# EAGLE design akabeacon_square_MDBT40 (EAGLE 7.2.0)
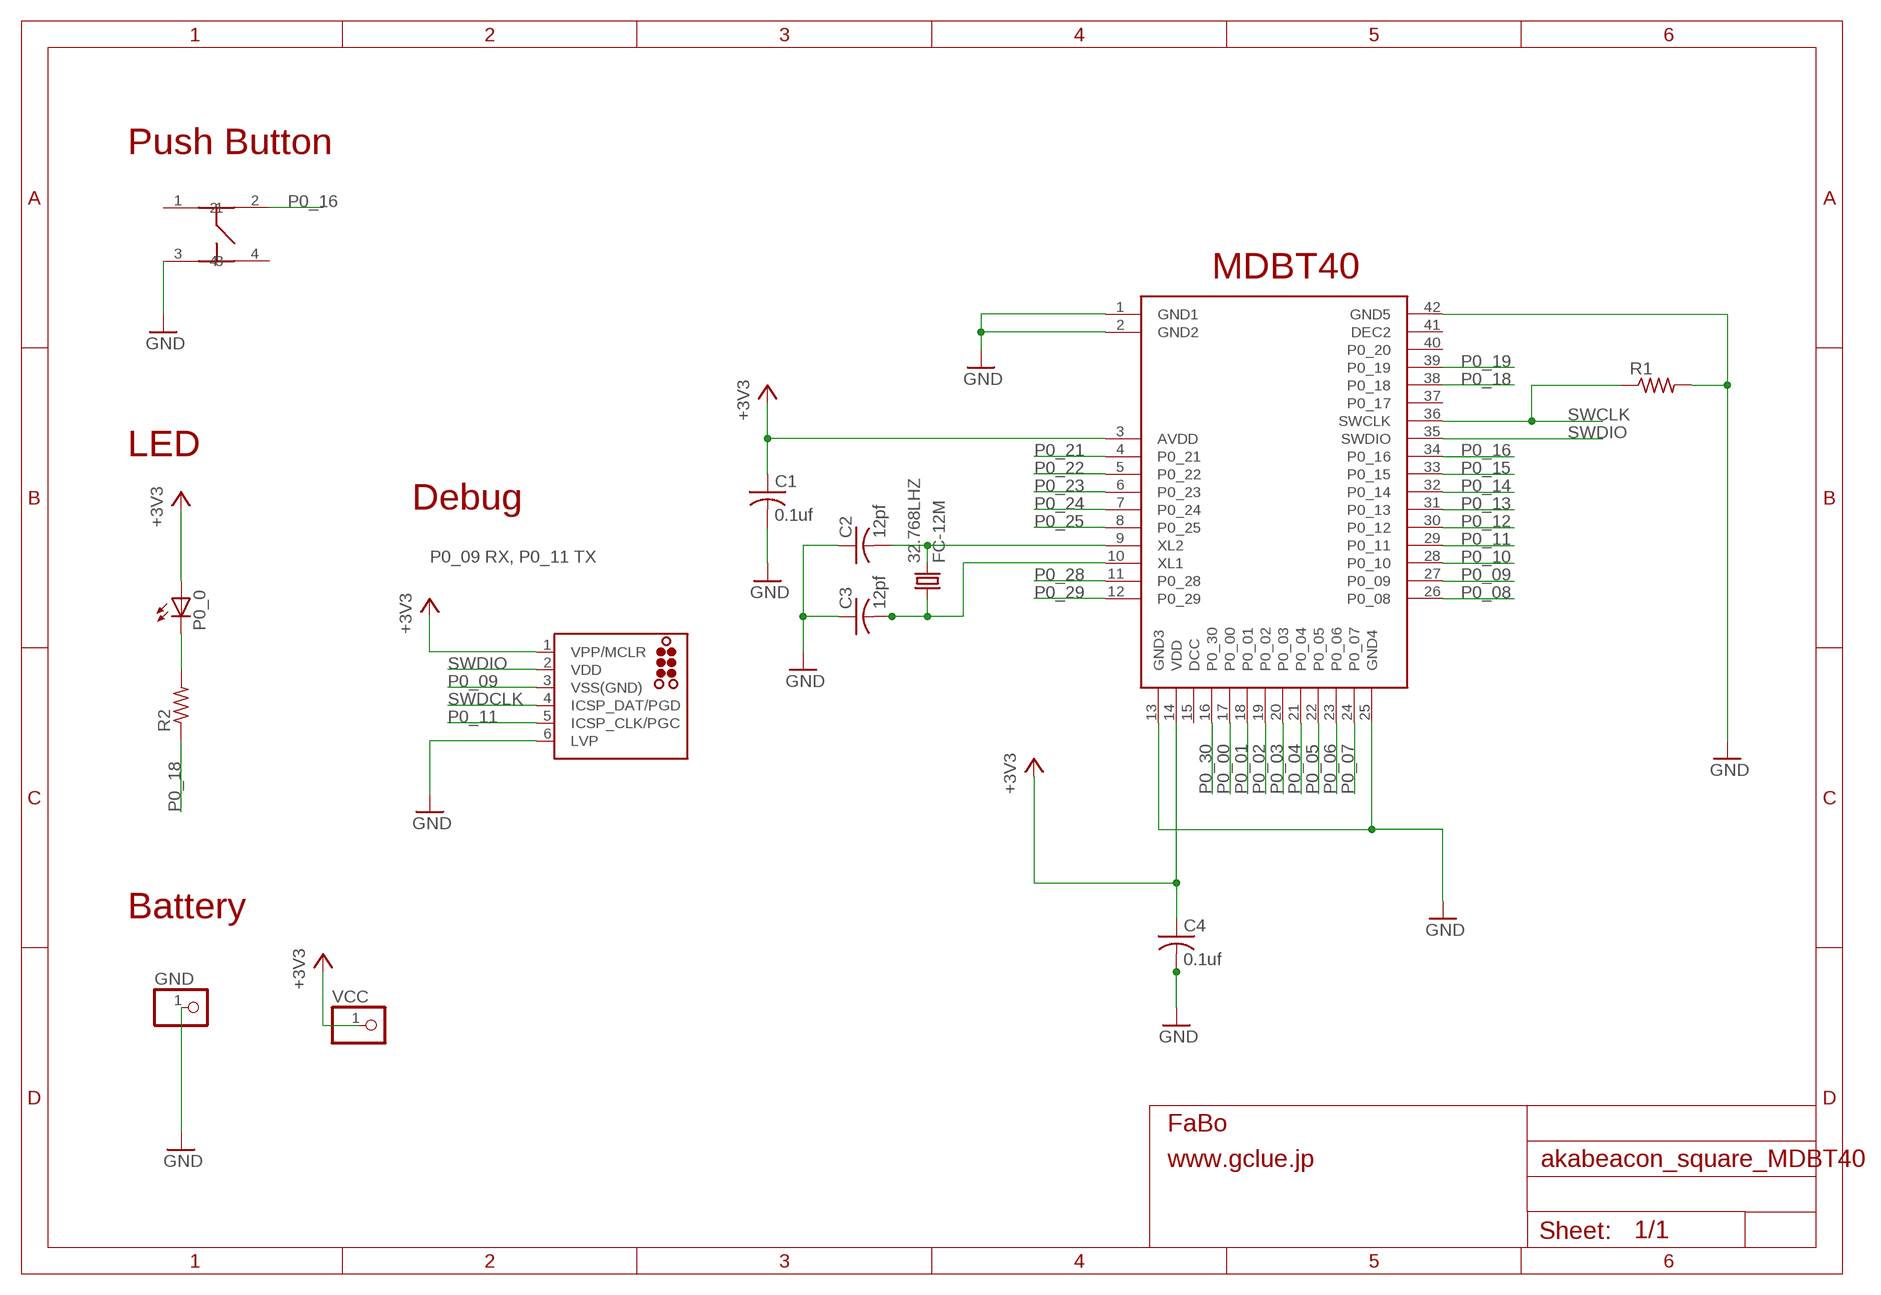
[diagram p0: schematic, sheet 1]

## Parts
32.768LHZ  FC-12M  [FC-12M]
C1  0.1uf  C-USC0603  [C0603]
C2  12pf  C-USC0603  [C0603]
C3  12pf  C-USC0603  [C0603]
C4  0.1uf  C-USC0603  [C0603]
GND  PINHD-1X1CB  [1X01-CLEANBIG]
J2  TC2030-MCP  [TC2030-MCP]
P0_0  LEDCHIP-LED0603  [CHIP-LED0603]
R1  R-US_R0603  [R0603]
R2  R-US_R0603  [R0603]
U$3  RAYTAC-MDBT40  [RAYTAC-MDBT40]
U$6  SWICTH-4P(KMR2)  [SWITCH-4P(KMR2)]
VCC  PINHD-1X1CB  [1X01-CLEANBIG]

## Nets
+3V3: C1.1 C4.1 J2.1(VPP/MCLR) P0_0.A U$3.3(AVDD) U$3.14(VDD) VCC.1
GND: C1.2 C2.1 C3.1 C4.2 GND.1 J2.6(LVP) R1.2 U$3.1(GND1) U$3.2(GND2) U$3.13(GND3) U$3.25(GND4) U$3.42(GND5) U$6.3
LED1: P0_0.C R2.2
N$7: 32.768LHZ.2 C2.2 U$3.9(XL2)
N$8: 32.768LHZ.1 C3.2 U$3.10(XL1)
P0_00: U$3.17(P0_00)
P0_01: U$3.18(P0_01)
P0_02: U$3.19(P0_02)
P0_03: U$3.20(P0_03)
P0_04: U$3.21(P0_04)
P0_05: U$3.22(P0_05)
P0_06: U$3.23(P0_06)
P0_07: U$3.24(P0_07)
P0_08: U$3.26(P0_08)
P0_09: J2.3(VSS(GND)) U$3.27(P0_09)
P0_10: U$3.28(P0_10)
P0_11: J2.5(ICSP_CLK/PGC) U$3.29(P0_11)
P0_12: U$3.30(P0_12)
P0_13: U$3.31(P0_13)
P0_14: U$3.32(P0_14)
P0_15: U$3.33(P0_15)
P0_16: U$3.34(P0_16) U$6.2
P0_18: R2.1 U$3.38(P0_18)
P0_19: U$3.39(P0_19)
P0_21: U$3.4(P0_21)
P0_22: U$3.5(P0_22)
P0_23: U$3.6(P0_23)
P0_24: U$3.7(P0_24)
P0_25: U$3.8(P0_25)
P0_28: U$3.11(P0_28)
P0_29: U$3.12(P0_29)
P0_30: U$3.16(P0_30)
SWCLK: R1.1 U$3.36(SWCLK)
SWDCLK: J2.4(ICSP_DAT/PGD)
SWDIO: J2.2(VDD) U$3.35(SWDIO)
Unconnected: U$3.15(DCC) U$3.37(P0_17) U$3.40(P0_20) U$3.41(DEC2) U$6.1 U$6.4

## Notes on the sheet
- Push Button
- MDBT40
- LED
- Debug
- P0_09 RX, P0_11 TX
- Battery

## Library data of the parts
32.768LHZ = crystal:FC-12M: kHz RANGE CRYSTAL UNIT LOW PROFILE SMD Source: Epson Toyocom FC-12M.pdf
C1-C4 = adafruit:C-US: CAPACITOR, American symbol
GND VCC = adafruit:PINHD-1X1: Pin header 1x1 for 0.1" spacing With round pins
J2 = tag-connect:TC2030: TAG-CONNECT ICSP Connector Manufacturer: Tag-Connect <http://www.tag-connect.com> Cable for easy In-Circuit Serial Programming. Designed for Microchip ICD2, suitable for many others. Two variants - one "with legs" (for hands-free fit on PCB) and another "without legs" for quick programming. PAD Description 1 MCLR/Vpp 2 Vdd 3 GND 4 PGD (ISPDAT) 5 PGC (ISPCLK) 6 nc (used for LVP) ©2009 ROFA.cz - modified and updated by Robert Darlington ‹rdarlington@gmail.com›
P0_0 = led:LED: LED OSRAM: - CHIPLED LG R971, LG N971, LY N971, LG Q971, LY Q971, LO R971, LY R971 LH N974, LH R974 LS Q976, LO Q976, LY Q976 LO Q996 - Hyper CHIPLED LW Q18S LB Q993, LB Q99A, LB R99A - SideLED LS A670, LO A670, LY A670, LG A670, LP A670 LB A673, LV A673, LT A673, LW A673 LH A674 LY A675 LS A676, LA A676, LO A676, LY A676, LW A676 LS A679, LY A679, LG A679 - Hyper Micro SIDELED® LS Y876, LA Y876, LO Y876, LY Y876 LT Y87S - SmartLED LW L88C, LW L88S LB L89C, LB L89S, LG L890 LS L89K, LO L89K, LY L89K LS L896, LA L896, LO L896, LY L896 - TOPLED LS T670, LO T670, LY T670, LG T670, LP T670 LSG T670, LSP T670, LSY T670, LOP T670, LYG T670 LG T671, LOG T671, LSG T671 LB T673, LV T673, LT T673, LW T673 LH T674 LS T676, LA T676, LO T676, LY T676, LB T676, LH T676, LSB T676, LW T676 LB T67C, LV T67C, LT T67C, LS T67K, LO T67K, LY T67K, LW E67C LS E67B, LA E67B, LO E67B, LY E67B, LB E67C, LV E67C, LT E67C LW T67C LS T679, LY T679, LG T679 LS T770, LO T770, LY T770, LG T770, LP T770 LB T773, LV T773, LT T773, LW T773 LH T774 LS E675, LA E675, LY E675, LS T675 LS T776, LA T776, LO T776, LY T776, LB T776 LHGB T686 LT T68C, LB T68C - Hyper Mini TOPLED® LB M676 - Mini TOPLED Santana® LG M470 LS M47K, LO M47K, LY M47K Source: http://www.osram.convergy.de LUXEON: - LUMILED® LXK2-PW12-R00, LXK2-PW12-S00, LXK2-PW14-U00, LXK2-PW14-V00 LXK2-PM12-R00, LXK2-PM12-S00, LXK2-PM14-U00 LXK2-PE12-Q00, LXK2-PE12-R00, LXK2-PE12-S00, LXK2-PE14-T00, LXK2-PE14-U00 LXK2-PB12-K00, LXK2-PB12-L00, LXK2-PB12-M00, LXK2-PB14-N00, LXK2-PB14-P00, LXK2-PB14-Q00 LXK2-PR12-L00, LXK2-PR12-M00, LXK2-PR14-Q00, LXK2-PR14-R00 LXK2-PD12-Q00, LXK2-PD12-R00, LXK2-PD12-S00 LXK2-PH12-R00, LXK2-PH12-S00 LXK2-PL12-P00, LXK2-PL12-Q00, LXK2-PL12-R00 Source: www.luxeon.com KINGBRIGHT: KA-3528ASYC Source: www.kingbright.com
R1 R2 = adafruit:R-US_: RESISTOR, American symbol
U$3 = gclueBT:RAYTAC-MDBT40
U$6 = gclue-test:SWICTH-4P(KMR2)

## Board
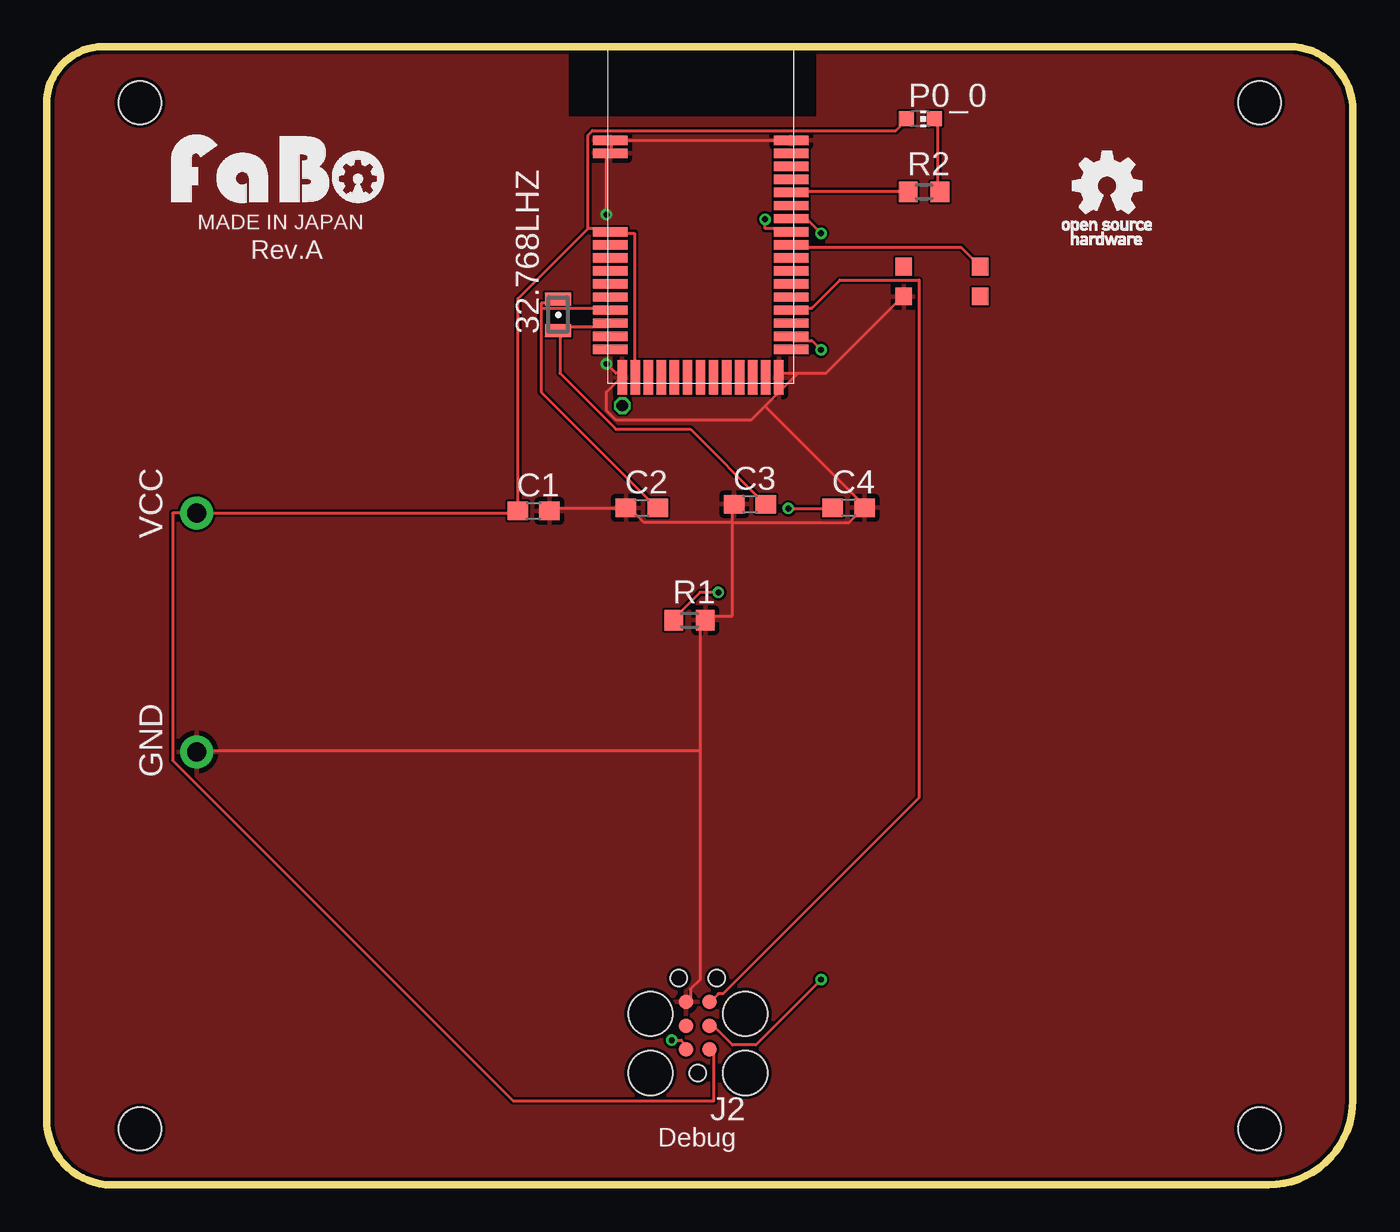
[diagram p1: board, top side]
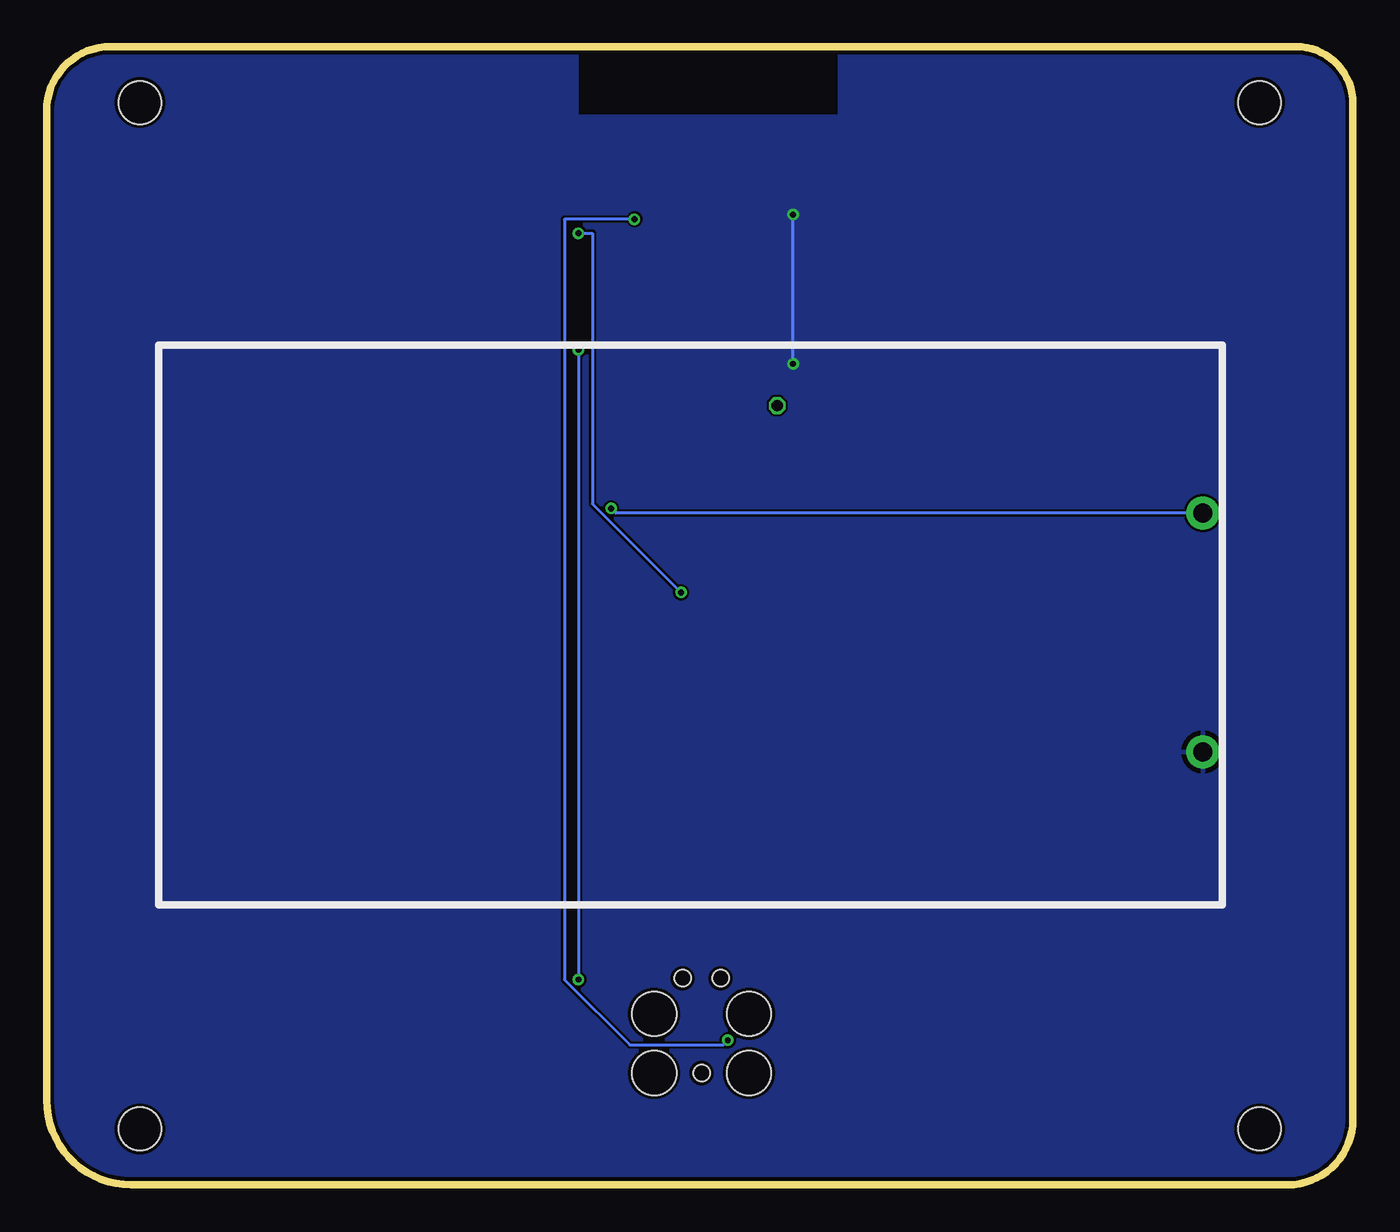
[diagram p2: board, bottom side, seen from below]

Size 70 x 61 mm. Coordinates in mm from the lower left corner, seen from the top.
Outline: 0,57.97 0,3.49 arc90 3.49,0 65.47,0 arc90 70,4.53 70,57.58 arc90 66.58,61 3.03,61 arc90 0,57.97
Copper layers (1*16): Top 0.035mm / dielectric 1.5mm / Bottom 0.035mm
Design rules "SeeedStudio_2layer_DRU_no_angle_20140221 *": minimum track width 6mil, minimum drill 12mil, track to track 5mil, track to pad 5mil, pad to pad 5mil, via to via 5mil, smd to smd 0mil, copper to edge 8mil, drill to drill 8mil, minimum pad ring 10mil, minimum via ring 6mil, stop-mask expansion 2mil, vias tented up to drill 100mil, thermal gap 10mil
Holes 2.3 mm at 5,3 5,58 65,58 65,3

### Footprints (pad centres in the part's own frame; a part is rotated, then mirrored left to right if it is on the bottom)
FC-12M = smd 0.7 x 1.4: 1 -0.85,0; 2 0.85,0
C0603 = smd 1.1 x 1: 1 -0.85,0; 2 0.85,0
1X01-CLEANBIG = drill 1.016 pad 1.778: 1 0,0
TC2030-MCP = smd 0.787 x 0.787: 1 1.27,-0.635; 2 1.27,0.635; 3 2.54,-0.635; 4 2.54,0.635; 5 3.81,-0.635; 6 3.81,0.635 | hole 0.889: 0,0; 5.08,-1.016; 5.08,1.016 | hole 2.375: 0,2.54; 0,-2.54; 3.175,-2.54; 3.175,2.54
CHIP-LED0603 = smd 0.8 x 0.8: A 0,-0.75; C 0,0.75
R0603 = smd 1 x 1.1: 1 -0.85,0; 2 0.85,0
RAYTAC-MDBT40 = smd 1.85 x 0.5: 1 -4.86,4; 2 -4.86,3.3; 3 -4.86,-0.9; 4 -4.86,-1.6; 5 -4.86,-2.3; 6 -4.86,-3; 7 -4.86,-3.7; 8 -4.86,-4.4; 9 -4.86,-5.1; 10 -4.86,-5.8; 11 -4.86,-6.5; 12 -4.86,-7.2; 26 4.84,-7.2; 27 4.84,-6.5; 28 4.84,-5.8; 29 4.84,-5.1; 30 4.84,-4.4; 31 4.84,-3.7; 32 4.84,-3; 33 4.84,-2.3; 34 4.84,-1.6; 35 4.84,-0.9; 36 4.84,-0.2; 37 4.84,0.5; 38 4.84,1.2; 39 4.84,1.9; 40 4.84,2.6; 41 4.84,3.3; 42 4.84,4 | smd 0.5 x 1.85: 13 -4.22,-8.71; 14 -3.52,-8.71; 15 -2.82,-8.71; 16 -2.12,-8.71; 17 -1.42,-8.71; 18 -0.72,-8.71; 19 -0.02,-8.71; 20 0.68,-8.71; 21 1.38,-8.71; 22 2.08,-8.71; 23 2.78,-8.71; 24 3.48,-8.71; 25 4.18,-8.71
SWITCH-4P(KMR2) = smd 0.9 x 0.95: 1 -1,0; 2 3.1,0; 3 -1,-1.6; 4 3.1,-1.6

### Placement (x,y rotation side)
32.768LHZ  27.41,46.63 90 top
C1  26.09,36.12 0 top
C2  31.89,36.28 0 top
C3  37.69,36.48 0 top
C4  42.98,36.29 0 top
GND  8.04,23.2 90 top
J2  34.9,5.99 90 top
P0_0  46.82,57.13 270 top
R1  34.45,30.26 0 top
R2  47.02,53.21 0 top
U$2  [LOGO_FABO_M]  12.39,52.63 0 top
U$3  35.06,51.98 0 top
U$4  [LOGO_OSHW_T_M]  56.83,53.53 0 top
U$6  46.93,49.21 0 top
VCC  8.04,36 90 top

### Tracks (layer width: path | path; a pad name or v marks a point on that pad's centre or on a via)
+3V3  (via drill 0.3)
  Top 0.152: 29,51.25 29,56.25 29.25,56.5 45.5,56.5 46,57 P0_0.A | 29,51.25 30,51.25 U$3.3 30.25,51 31.5,51 31.5,43.5 U$3.14 | J2.1 35.75,7.25 35.75,4.5 25,4.5 6.75,22.75 6.75,36 VCC.1 25,36 C1.1 25.25,36.25 25.25,47.5 29,51.25 | v39.75,36.25 42,36.25 C4.1
  Bottom 0.152: v39.75,36.25 39.5,36 VCC.1
GND  (via drill 0.3)
  Top 0.152: U$3.42 39.75,56 30.25,56 U$3.1 30.25,55.75 30.25,55.5 U$3.2 30,55.25 v30,52 | 40.25,43.5 39.25,43.5 U$3.25 | 40.25,43.5 41.75,43.5 45.75,47.5 U$6.3 | 40.25,43.5 38.5,41.75 | 38.5,41.75 37.75,41 30.5,41 30,41.5 30,42.5 30.75,43.25 U$3.13 30.75,43.5 30.5,43.5 v30,44 | C1.2 27,36.25 31,36.25 C2.1 31.25,36.25 32,35.5 36.75,35.5 | 35,23.25 35,30.25 35.25,30.25 R1.2 35.5,30.5 36.75,30.5 36.75,35.5 | 35,23.25 35,11 34.5,10.5 34.5,10 J2.6 | 36.75,35.5 36.75,36.25 C3.1 | 36.75,35.5 43,35.5 43.75,36.25 C4.2 43.75,36.5 38.5,41.75 | 35,23.25 8.25,23.25 GND.1
  Bottom 0.152: v30,44 v30,52
  pour Bottom: 0,-0.25 69.96,-0.25 69.96,61.92 41.61,61.92 41.61,57.25 27.49,57.25 27.49,61.55 -0.37,61.55 -0.37,-0.49
  pour Top: -0.25,-0.37 70.32,-0.37 70.32,62.78 41.36,62.78 41.36,57.13 27.86,57.13 27.86,62.66 -0.49,62.66 -0.49,-0.74
LED1
  Top 0.152: P0_0.C 47.75,57 47.75,53.25 R2.2
N$1  (via drill 0.6)
  other vias: 30.85,41.76
N$7
  Top 0.152: 26.5,47 26.5,47.25 27.25,47.25 32.768LHZ.2 | 26.5,47 26.5,42.5 32.5,36.5 C2.2 | 26.5,47 30,47 U$3.9
N$8
  Top 0.152: C3.2 38.5,36.5 34.5,40.5 30.5,40.5 27.5,43.5 27.5,45.75 32.768LHZ.1 27.5,46 30,46 U$3.10
P0_09  (via drill 0.3)
  Top 0.152: v41.5,11 38,7.5 36.75,7.5 35.75,8.5 J2.3 | v41.5,44.75 41,45.25 40,45.25 U$3.27
  Bottom 0.152: v41.5,44.75 v41.5,11
P0_11
  Top 0.152: J2.5 35.75,10 36,10.25 36.25,10.25 46.75,20.75 46.75,48.5 42.5,48.5 41,47 40,47 U$3.29
P0_16
  Top 0.152: U$6.2 50,49.25 49,50.25 40,50.25 U$3.34
P0_18
  Top 0.152: R2.1 46,53.25 40,53.25 U$3.38
SWCLK  (via drill 0.3)
  Top 0.152: v36,31.75 35,31.75 33.75,30.5 R1.1 | v41.5,51 40.75,51.75 40,51.75 U$3.36
  Bottom 0.152: v36,31.75 40.75,36.5 40.75,51 v41.5,51
SWDIO  (via drill 0.3)
  Top 0.152: v33.5,7.75 34,7.75 34.25,7.5 J2.2 | v38.5,51.75 38.5,51.25 39.75,51.25 U$3.35
  Bottom 0.152: v33.5,7.75 33.75,7.5 38.75,7.5 42.25,11 42.25,51.75 v38.5,51.75

### Text on the board
tPlace: MADE IN JAPAN | Rev.A | Debug